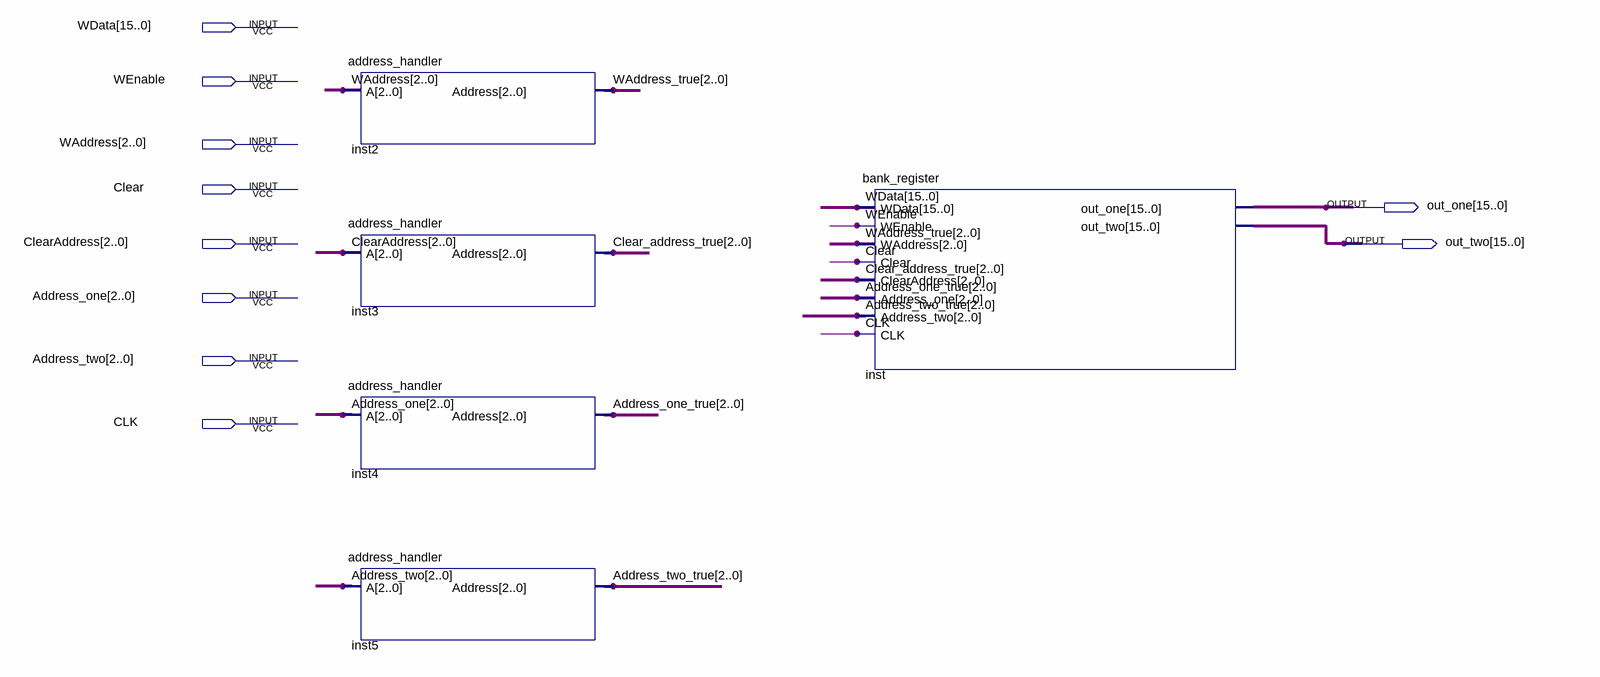
[diagram p0: schematic sheet]
// Quartus schematic Memory.bdf as structural Verilog: 5 symbols, 10 pins
module Memory (
  input  [15:0] WData,
  input  WEnable,
  input  [2:0] WAddress,
  input  Clear,
  input  [2:0] ClearAddress,
  input  [2:0] Address_one,
  input  [2:0] Address_two,
  input  CLK,
  output [15:0] out_one,
  output [15:0] out_two
);

  wire [2:0] Address_one_true, Address_two_true, Clear_address_true, WAddress_true;

  address_handler inst2 (.A(WAddress), .Address(WAddress_true));
  address_handler inst3 (.A(ClearAddress), .Address(Clear_address_true));
  address_handler inst4 (.A(Address_one), .Address(Address_one_true));
  address_handler inst5 (.A(Address_two), .Address(Address_two_true));
  bank_register inst (
    .WData(WData), .WEnable(WEnable), .WAddress(WAddress_true), .Clear(Clear),
    .ClearAddress(Clear_address_true), .Address_one(Address_one_true), .Address_two(Address_two_true),
    .CLK(CLK), .out_one(out_one), .out_two(out_two));
endmodule
